# Altium schematic sheet Output.Schematic.SchDoc
size A
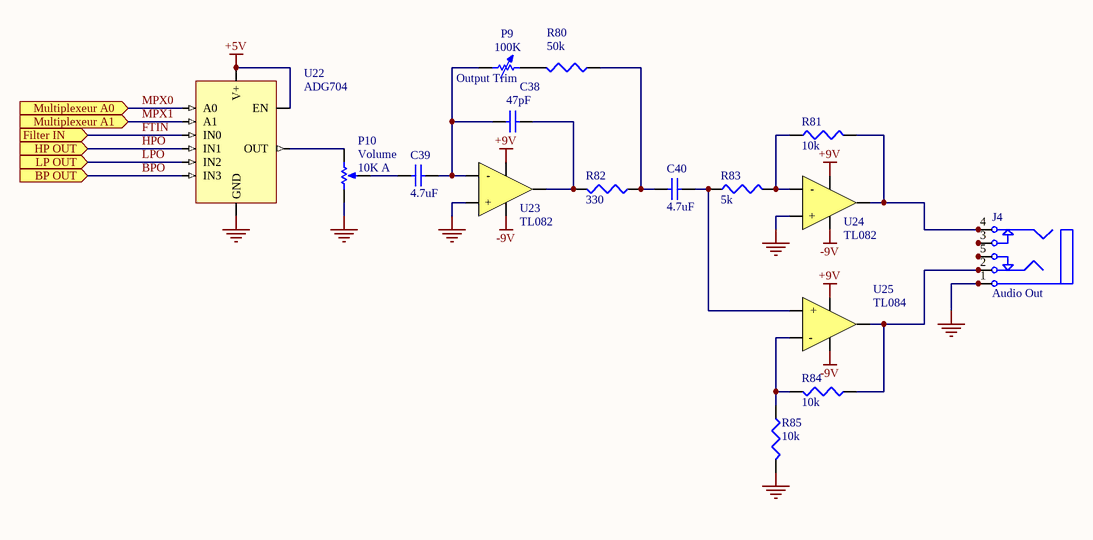
[diagram p0: Output.Schematic.SchDoc]

## Parts
C38  47pF  [CAPC1608N]
C39  4.7uF  [CAP1608N]
C40  4.7uF  [CAPC1608N]
J4  Audio Out  [ST-3150-5N]
P9  Output Trim  value 100K  [AXIAL-0.7]
P10  Volume  value 10K A  [VR5]
R80  50k  [CAPC1608N]
R81  10k  [CAPC1608N]
R82  330  [CAPC1608N]
R83  5k  [CAPC1608N]
R84  10k  [J1-0603]
R85  10k  [RESC6332]
U22  ADG704
U23  TL082
U24  TL082
U25  TL084

## Ports
BP OUT (in), Filter IN (in), HP OUT (in), LP OUT (in), Multiplexeur A0 (in), Multiplexeur A1 (in)

## Nets
+5V: U22.5(EN) U22.6(V+)
+9V: U23.8(VCC+) U24.8(VCC+) U25.4(VCC+)
-9V: U23.4(VCC-) U24.4(VCC-) U25.11(VCC-)
GND: J4.1 J4.1A J4.1B P10.1(TOP) R85.2 U22.3(GND) U23.3(+) U24.3(+)
BPO: U22.7(IN3) ; port BP OUT
FTIN: U22.2(IN0) ; port Filter IN
HPO: U22.9(IN1) ; port HP OUT
LPO: U22.4(IN2) ; port LP OUT
MPX0: U22.1(A0) ; port Multiplexeur A0
MPX1: U22.10(A1) ; port Multiplexeur A1
NetC38_1: C38.1 C39.2 P9.1 U23.2(-)
NetC38_2: C38.2 R82.2 U23.1(OUT)
NetC39_1: C39.1 P10.3(TAP)
NetC40_1: C40.1 R80.1 R82.1
NetC40_2: C40.2 R83.1 U25.2(+)
NetJ4_2: J4.2 J4.2A J4.2B R84.1 U25.1(OUT)
NetJ4_3: J4.3 J4.3A J4.3B
NetJ4_4: J4.4 J4.4A J4.4B R81.2 U24.1(OUT)
NetJ4_5: J4.5 J4.5A J4.5B
NetP9_2: P9.2 R80.2
NetP10_2: P10.2(BOT) U22.8(OUT)
NetR81_1: R81.1 R83.2 U24.2(-)
NetR84_2: R84.2 R85.1 U25.3(-)

## Library data of the parts
C38 = Cap Semi: Capacitor (Semiconductor SIM Model); Published: 8-Jun-2000; LatestRevisionDate: 29-May-2009; LatestRevisionNote: IPC-7351 Footprint Added.; PackageReference: C1206; Publisher: Altium Limited; PackageDescription: Chip Capacitor; Value: 47pF
C39 C40 = Cap Semi: Capacitor (Semiconductor SIM Model); Value: 4.7u; Published: 8-Jun-2000; LatestRevisionDate: 29-May-2009; LatestRevisionNote: IPC-7351 Footprint Added.; PackageReference: C1206; Publisher: Altium Limited; PackageDescription: Chip Capacitor
J4 = Phonejack Stereo SW: 3-Conductor Jack with 2 break contacts (normals) and 2 auxiliary make contacts; Published: 5-Jan-2004; LatestRevisionDate: 17-Dec-2003; LatestRevisionNote: PCB Footprint replaced.; DatasheetDocument: 07-Mar-2000; Publisher: Altium Limited; ComponentLink1Description: Manufacturer Link; ComponentLink1URL: http://domino.kycon.com/internet/Products.html
P9 = Res Adj1: Variable Resistor; Set Position: 0.5; Published: 8-Jun-2000; LatestRevisionDate: 17-Jul-2002; LatestRevisionNote: Re-released for DXP Platform.; PackageReference: AXIAL-0.7; Publisher: Altium Limited; PackageDescription: Axial Device, Thru-Hole; 2 Leads; 0.7 in Pin Spacing
P10 = RPot: Potentiometer; Sim Note: Enter the Resistance value and the set point into parameter fields.; Set Position: 0.5; Published: 8-Jun-2000; LatestRevisionDate: 17-Jul-2002; LatestRevisionNote: Re-released for DXP Platform.; PackageReference: VR5; Publisher: Altium Limited; PackageDescription: Variable Resistor, Thru-Hole; 3 Leads
R80-R85 = Res3: Resistor; Published: 8-Jun-2000; LatestRevisionDate: 29-May-2009; LatestRevisionNote: IPC-7351 Footprint Added.; PackageReference: J1-0603; Publisher: Altium Limited; PackageDescription: Chip Resistor
  R80: Value: 50K
  R81 R84 R85: Value: 10K
  R82: Value: 330
  R83: Value: 5K